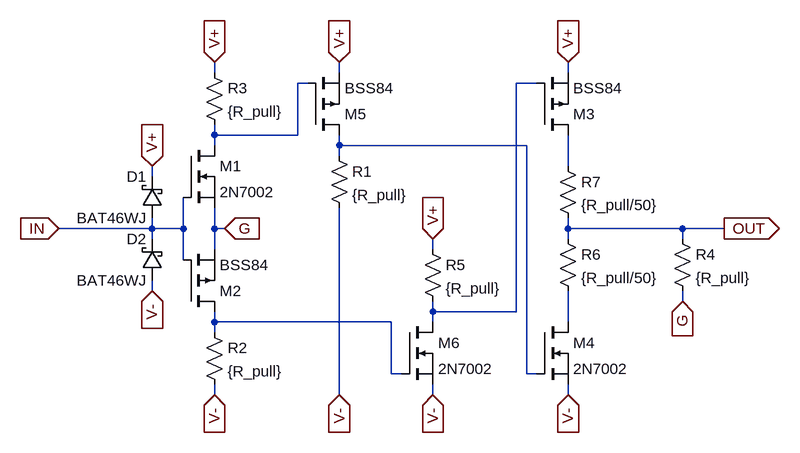
[diagram p0: schematic tri_inv.asc]
tri_inv.asc, the LTspice schematic file:
Version 4
SHEET 1 1132 680
WIRE 32 -32 32 -48
WIRE 224 -32 224 -48
WIRE 576 -32 576 -48
WIRE 176 -16 160 -16
WIRE 528 -16 496 -16
WIRE 32 64 32 48
WIRE 160 64 160 -16
WIRE 160 64 32 64
WIRE 32 80 32 64
WIRE 224 80 224 64
WIRE 512 80 224 80
WIRE 224 96 224 80
WIRE 576 112 576 64
WIRE -64 128 -64 112
WIRE -64 208 -64 192
WIRE -64 208 -208 208
WIRE -16 208 -16 160
WIRE -16 208 -64 208
WIRE 32 208 32 176
WIRE 48 208 32 208
WIRE 576 208 576 192
WIRE 752 208 576 208
WIRE 816 208 752 208
WIRE -64 224 -64 208
WIRE 576 224 576 208
WIRE 752 224 752 208
WIRE 32 240 32 208
WIRE 368 240 368 224
WIRE -16 256 -16 208
WIRE -64 304 -64 288
WIRE 752 320 752 304
WIRE 368 336 368 320
WIRE 496 336 496 -16
WIRE 496 336 368 336
WIRE 32 352 32 336
WIRE 304 352 32 352
WIRE 368 352 368 336
WIRE 576 352 576 304
WIRE 32 368 32 352
WIRE 304 432 304 352
WIRE 320 432 304 432
WIRE 512 432 512 80
WIRE 528 432 512 432
WIRE 32 464 32 448
WIRE 224 464 224 176
WIRE 368 464 368 448
WIRE 576 464 576 448
FLAG -64 112 V+
IOPIN -64 112 In
FLAG -64 304 V-
IOPIN -64 304 In
FLAG 752 320 G
IOPIN 752 320 In
FLAG -208 208 IN
IOPIN -208 208 In
FLAG 816 208 OUT
IOPIN 816 208 Out
FLAG 32 -48 V+
IOPIN 32 -48 In
FLAG 224 -48 V+
IOPIN 224 -48 In
FLAG 368 224 V+
IOPIN 368 224 In
FLAG 576 -48 V+
IOPIN 576 -48 In
FLAG 32 464 V-
IOPIN 32 464 In
FLAG 224 464 V-
IOPIN 224 464 In
FLAG 368 464 V-
IOPIN 368 464 In
FLAG 576 464 V-
IOPIN 576 464 In
FLAG 48 208 G
IOPIN 48 208 In
SYMBOL nmos -16 80 R0
SYMATTR InstName M1
SYMATTR Value 2N7002
SYMBOL pmos -16 336 M180
SYMATTR InstName M2
SYMATTR Value BSS84
SYMBOL schottky -48 192 R180
WINDOW 0 24 64 Left 2
WINDOW 3 24 0 Left 2
SYMATTR InstName D1
SYMATTR Value BAT46WJ
SYMATTR Description Diode
SYMATTR Type diode
SYMBOL schottky -48 288 R180
WINDOW 0 24 64 Left 2
WINDOW 3 24 0 Left 2
SYMATTR InstName D2
SYMATTR Value BAT46WJ
SYMATTR Description Diode
SYMATTR Type diode
SYMBOL res 16 352 R0
SYMATTR InstName R2
SYMATTR Value {R_pull}
SYMBOL res 16 -48 R0
SYMATTR InstName R3
SYMATTR Value {R_pull}
SYMBOL pmos 528 64 M180
SYMATTR InstName M3
SYMATTR Value BSS84
SYMBOL nmos 528 352 R0
SYMATTR InstName M4
SYMATTR Value 2N7002
SYMBOL res 736 208 R0
SYMATTR InstName R4
SYMATTR Value {R_pull}
SYMBOL pmos 176 64 M180
SYMATTR InstName M5
SYMATTR Value BSS84
SYMBOL res 208 80 R0
SYMATTR InstName R1
SYMATTR Value {R_pull}
SYMBOL nmos 320 352 R0
SYMATTR InstName M6
SYMATTR Value 2N7002
SYMBOL res 352 224 R0
SYMATTR InstName R5
SYMATTR Value {R_pull}
SYMBOL res 560 208 R0
SYMATTR InstName R6
SYMATTR Value {R_pull/50}
SYMBOL res 560 96 R0
SYMATTR InstName R7
SYMATTR Value {R_pull/50}

The netlist it stands for:
* tri_inv.asc
M1 N001 IN G G 2N7002
M2 N005 IN G G BSS84
D1 IN V+ BAT46WJ
D2 V- IN BAT46WJ
R2 N005 V- {R_pull}
R3 V+ N001 {R_pull}
M3 N004 N002 V+ V+ BSS84
M4 N006 N003 V- V- 2N7002
R4 OUT G {R_pull}
M5 N003 N001 V+ V+ BSS84
R1 N003 V- {R_pull}
M6 N002 N005 V- V- 2N7002
R5 V+ N002 {R_pull}
R6 OUT N006 {R_pull/50}
R7 N004 OUT {R_pull/50}
.model D D
.lib standard.dio
.model NMOS NMOS
.model PMOS PMOS
.lib standard.mos
.backanno
.end